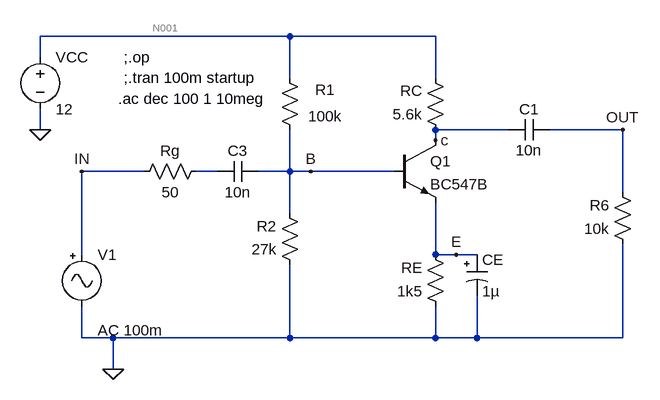
[diagram p0: schematic Ej 2.asc]
Ej 2.asc, the LTspice schematic file:
Version 4
SHEET 1 880 680
WIRE 256 -64 -128 -64
WIRE 480 -64 256 -64
WIRE -128 -32 -128 -64
WIRE 256 0 256 -64
WIRE 480 0 480 -64
WIRE -128 80 -128 48
WIRE 592 80 480 80
WIRE 768 80 656 80
WIRE 480 96 480 80
WIRE 32 144 -64 144
WIRE 144 144 112 144
WIRE 256 144 256 80
WIRE 256 144 208 144
WIRE 288 144 256 144
WIRE 416 144 288 144
WIRE 768 176 768 80
WIRE 256 208 256 144
WIRE -64 272 -64 144
WIRE 480 272 480 192
WIRE 512 272 480 272
WIRE 544 272 512 272
WIRE -64 400 -64 352
WIRE -16 400 -64 400
WIRE 256 400 256 288
WIRE 256 400 -16 400
WIRE 480 400 480 352
WIRE 480 400 256 400
WIRE 544 400 544 336
WIRE 544 400 480 400
WIRE 768 400 768 256
WIRE 768 400 544 400
WIRE -16 448 -16 400
FLAG -128 80 0
FLAG -16 448 0
FLAG 768 80 OUT
FLAG -64 144 IN
FLAG 288 144 B
FLAG 512 272 E
FLAG 480 96 c
SYMBOL res 128 128 R90
WINDOW 0 0 56 VBottom 2
WINDOW 3 32 56 VTop 2
SYMATTR InstName Rg
SYMATTR Value 50
SYMBOL res 272 96 R180
WINDOW 0 -54 78 Left 2
WINDOW 3 -65 37 Left 2
SYMATTR InstName R1
SYMATTR Value 100k
SYMBOL res 272 304 R180
WINDOW 0 36 76 Left 2
WINDOW 3 36 40 Left 2
SYMATTR InstName R2
SYMATTR Value 27k
SYMBOL res 496 368 R180
WINDOW 0 36 76 Left 2
WINDOW 3 36 40 Left 2
SYMATTR InstName RE
SYMATTR Value 1k5
SYMBOL res 496 96 R180
WINDOW 0 36 76 Left 2
WINDOW 3 36 40 Left 2
SYMATTR InstName RC
SYMATTR Value 5.6k
SYMBOL res 784 272 R180
WINDOW 0 36 76 Left 2
WINDOW 3 36 40 Left 2
SYMATTR InstName R6
SYMATTR Value 10k
SYMBOL cap 656 64 R90
WINDOW 0 0 32 VBottom 2
WINDOW 3 32 32 VTop 2
SYMATTR InstName C1
SYMATTR Value 10n
SYMBOL cap 144 160 R270
WINDOW 0 32 32 VTop 2
WINDOW 3 0 32 VBottom 2
SYMATTR InstName C3
SYMATTR Value 10n
SYMBOL voltage -128 -48 R0
WINDOW 123 0 0 Left 0
WINDOW 39 0 0 Left 0
SYMATTR InstName VCC
SYMATTR Value 12
SYMBOL npn 416 96 R0
SYMATTR InstName Q1
SYMATTR Value BC547B
SYMBOL polcap 528 272 R0
SYMATTR InstName CE
SYMATTR Value 1µ
SYMBOL Misc\\signal -64 256 R0
WINDOW 123 24 132 Left 2
WINDOW 39 0 0 Left 0
SYMATTR InstName V1
SYMATTR Value ""
SYMATTR Value2 AC 100m
TEXT 0 -32 Left 2 !;.op
TEXT 0 0 Left 2 !;.tran 100m startup
TEXT -8 32 Left 2 !.ac dec 100 1 10meg

The netlist it stands for:
* Ej 2.asc
Rg N002 IN 50
R1 B N001 100k
R2 0 B 27k
RE 0 E 1k5
RC c N001 5.6k
R6 0 OUT 10k
C1 OUT c 10n
C3 N002 B 10n
VCC N001 0 12
Q1 c B E 0 BC547B
CE E 0 1µ
V1 IN 0 AC 100m
.model NPN NPN
.model PNP PNP
.lib standard.bjt
;.op
;.tran 100m startup
.ac dec 100 1 10meg
.backanno
.end

* Results of the author's LTspice run, read from the files saved beside the schematic
* Operating Point, zero values left out:
*   V(b) = 2.464 V
*   V(n001) = 12 V
*   V(e) = 1.821 V
*   V(c) = 5.225 V
*   Ic(Q1) = 1.21 mA
*   Ib(Q1) = 4.106 µA
*   Ie(Q1) = -1.214 mA
*   I(Rc) = -1.21 mA
*   I(Re) = -1.214 mA
*   I(R2) = -91.26 µA
*   I(R1) = -95.36 µA
*   I(Vcc) = -1.305 mA
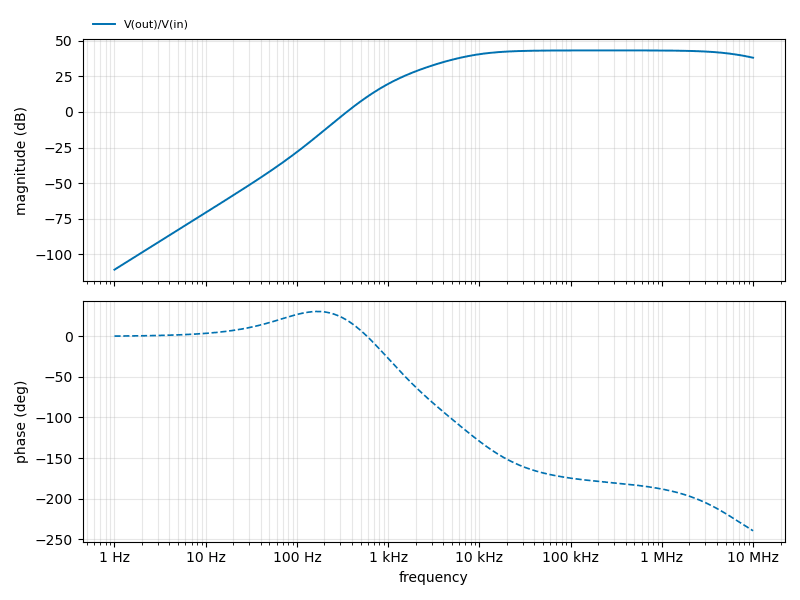
[diagram p1: AC Analysis of Ej 2.asc, plotted from the saved traces]
* AC Analysis, 1 run:
*   V(out)/V(in): -110.71 dB at 1 Hz, 38.09 dB at 10 MHz, peak 43.20 dB at 245.5 kHz, 3 dB below the peak at 9.22 kHz and 6.691 MHz